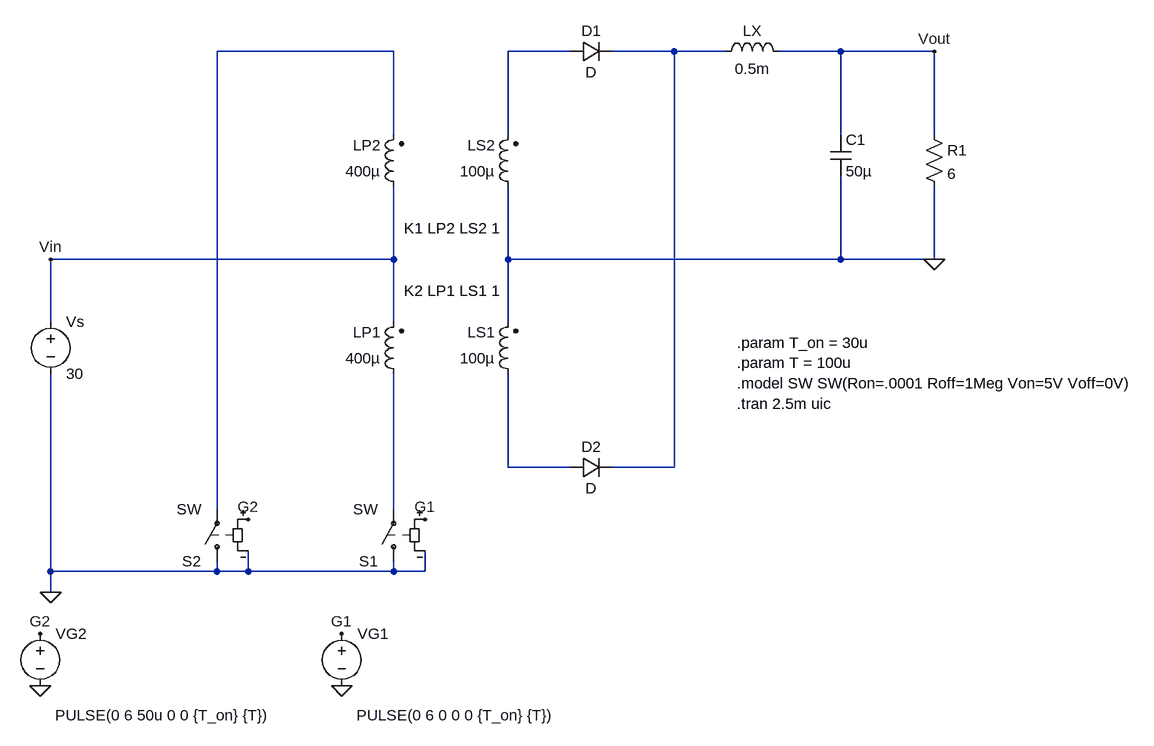
[diagram p0: schematic push_pull_converter.asc]
push_pull_converter.asc, the LTspice schematic file:
Version 4
SHEET 1 1856 1088
WIRE 704 32 432 32
WIRE 976 32 880 32
WIRE 1136 32 1040 32
WIRE 1216 32 1136 32
WIRE 1392 32 1296 32
WIRE 1536 32 1392 32
WIRE 704 160 704 32
WIRE 880 160 880 32
WIRE 1392 160 1392 32
WIRE 1536 160 1536 32
WIRE 704 352 704 240
WIRE 704 352 176 352
WIRE 880 352 880 240
WIRE 1392 352 1392 224
WIRE 1392 352 880 352
WIRE 1536 352 1536 240
WIRE 1536 352 1392 352
WIRE 176 448 176 352
WIRE 704 448 704 352
WIRE 880 448 880 352
WIRE 880 672 880 528
WIRE 976 672 880 672
WIRE 1136 672 1136 32
WIRE 1136 672 1040 672
WIRE 432 736 432 32
WIRE 704 736 704 528
WIRE 176 832 176 528
WIRE 432 832 432 816
WIRE 432 832 176 832
WIRE 480 832 480 800
WIRE 480 832 432 832
WIRE 704 832 704 816
WIRE 704 832 480 832
WIRE 752 832 752 800
WIRE 752 832 704 832
WIRE 176 864 176 832
FLAG 176 864 0
FLAG 176 352 Vin
FLAG 1536 32 Vout
FLAG 160 1008 0
FLAG 624 1008 0
FLAG 752 752 G1
FLAG 624 928 G1
FLAG 480 752 G2
FLAG 160 928 G2
FLAG 1536 352 0
SYMBOL voltage 176 432 R0
WINDOW 123 0 0 Left 2
WINDOW 39 0 0 Left 2
SYMATTR InstName Vs
SYMATTR Value 30
SYMBOL sw 704 832 R180
SYMATTR InstName S1
SYMBOL voltage 624 912 R0
WINDOW 3 23 141 Left 2
WINDOW 123 0 0 Left 2
WINDOW 39 0 0 Left 2
SYMATTR Value PULSE(0 6 0 0 0 {T_on} {T})
SYMATTR InstName VG1
SYMBOL ind2 720 256 R180
WINDOW 0 36 80 Left 2
WINDOW 3 36 40 Left 2
SYMATTR InstName LP2
SYMATTR Value 400µ
SYMATTR Type ind
SYMBOL ind2 896 256 R180
WINDOW 0 36 80 Left 2
WINDOW 3 36 40 Left 2
SYMATTR InstName LS2
SYMATTR Value 100µ
SYMATTR Type ind
SYMBOL diode 976 48 R270
WINDOW 0 32 32 VTop 2
WINDOW 3 0 32 VBottom 2
SYMATTR InstName D1
SYMBOL res 1520 144 R0
SYMATTR InstName R1
SYMATTR Value 6
SYMBOL ind2 720 544 R180
WINDOW 0 36 80 Left 2
WINDOW 3 36 40 Left 2
SYMATTR InstName LP1
SYMATTR Value 400µ
SYMATTR Type ind
SYMBOL ind2 896 544 R180
WINDOW 0 36 80 Left 2
WINDOW 3 36 40 Left 2
SYMATTR InstName LS1
SYMATTR Value 100µ
SYMATTR Type ind
SYMBOL diode 976 688 R270
WINDOW 0 32 32 VTop 2
WINDOW 3 0 32 VBottom 2
SYMATTR InstName D2
SYMBOL ind 1200 48 R270
WINDOW 0 32 56 VTop 2
WINDOW 3 5 56 VBottom 2
SYMATTR InstName LX
SYMATTR Value 0.5m
SYMBOL sw 432 832 R180
SYMATTR InstName S2
SYMBOL voltage 160 912 R0
WINDOW 3 23 141 Left 2
WINDOW 123 0 0 Left 2
WINDOW 39 0 0 Left 2
SYMATTR Value PULSE(0 6 50u 0 0 {T_on} {T})
SYMATTR InstName VG2
SYMBOL cap 1376 160 R0
SYMATTR InstName C1
SYMATTR Value 50µ
TEXT 1232 480 Left 2 !.param T_on = 30u\n.param T = 100u\n.model SW SW(Ron=.0001 Roff=1Meg Von=5V Voff=0V)\n.tran 2.5m uic
TEXT 720 304 Left 2 !K1 LP2 LS2 1
TEXT 720 400 Left 2 !K2 LP1 LS1 1

The netlist it stands for:
* push_pull_converter.asc
Vs Vin 0 30
S1 0 N005 G1 0 SW
VG1 G1 0 PULSE(0 6 0 0 0 {T_on} {T})
LP2 Vin N001 400µ
LS2 0 N002 100µ
D1 N002 N003 D
R1 Vout 0 6
LP1 N005 Vin 400µ
LS1 N004 0 100µ
D2 N004 N003 D
LX N003 Vout 0.5m
S2 0 N001 G2 0 SW
VG2 G2 0 PULSE(0 6 50u 0 0 {T_on} {T})
C1 Vout 0 50µ
.model D D
.lib standard.dio
.param T_on = 30u
.param T = 100u
.model SW SW(Ron=.0001 Roff=1Meg Von=5V Voff=0V)
.tran 2.5m uic
K1 LP2 LS2 1
K2 LP1 LS1 1
.backanno
.end